# Altium project Current_sensor.PrjPcb
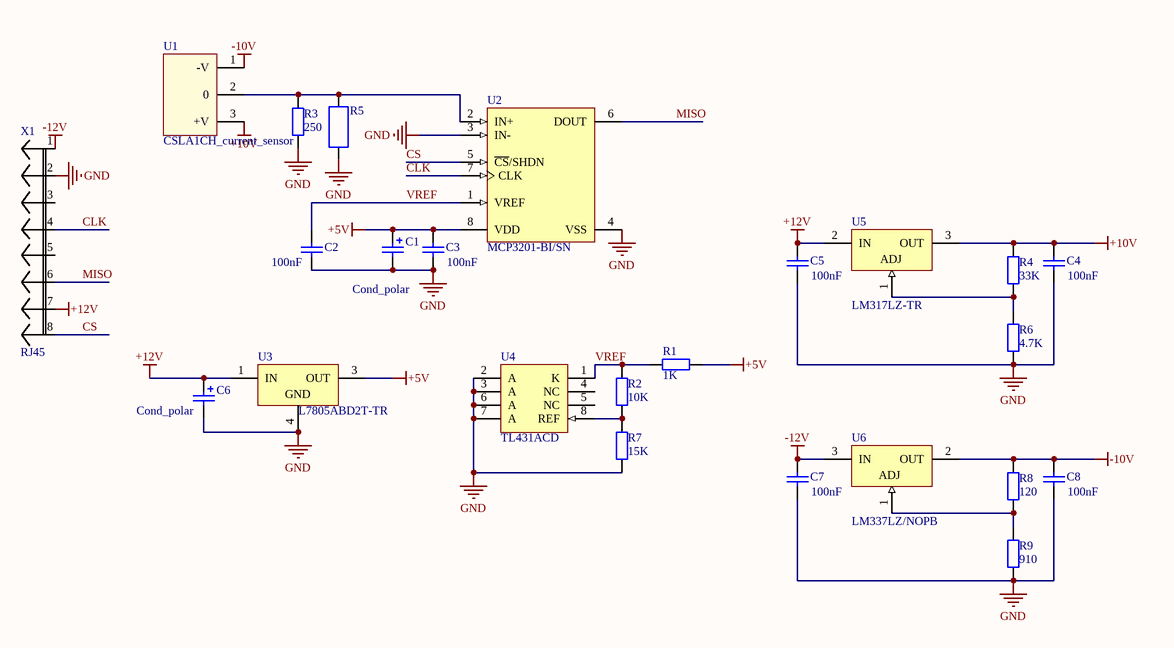
[diagram p0: Current_sensor.SchDoc]
1 sheet, 24 parts. Net scope: global (net labels, ports and power ports of the same name join across sheets).
Board file: Current_sensor.PcbDoc

## Sheet Current_sensor.SchDoc
size A4

### Parts
C1  Cond_polar  [CAP_EL_SMD_6.3mm]
C2  100nF  [C0805]
C3  100nF  [C0805]
C4  100nF  [C0805]
C5  100nF  [C0805]
C6  Cond_polar  [CAP_EL_SMD_6.3mm]
C7  100nF  [C0805]
C8  100nF  [C0805]
R1  1K  [R0805]
R2  10K  [R0805]
R3  250  [R0805]
R4  33K  [R0805]
R5  Resirtor_vivodnoi  [res_vivod]  (value not drawn)
R6  4.7K  [R0805]
R7  15K  [R0805]
R8  120  [R0805]
R9  910  [R0805]
U1  CSLA1CH_current_sensor  [CSLA1CH_current_sensor]
U2  MCP3201-BI/SN  [SO8]
U3  L7805ABD2T-TR  [TO-263_N]
U4  TL431ACD  [SO8_N]
U5  LM317LZ-TR  [TO-92]
U6  LM337LZ/NOPB  [Z03A]
X1  RJ45  [RJ45]

### Nets
+5V: C1.1 C3.2 R1.1 U2.8(VDD) U3.3(OUT)
+10V: C4.2 R4.1 U1.3(+V) U5.3(OUT)
+12V: C5.2 C6.1 U3.1(IN) U5.2(IN) X1.7
-10V: C8.2 R8.1 U1.1(-V) U6.2(OUT)
-12V: C7.2 U6.3(IN) X1.1
GND: C1.2 C2.1 C3.1 C4.1 C5.1 C6.2 C7.1 C8.1 R3.2 R5.1 R6.2 R7.1 R9.2 U2.3(IN-) U2.4(VSS) U3.4(GND) U4.2(A) U4.3(A) U4.6(A) U4.7(A) X1.2
CLK: U2.7(CLK) X1.4
CS: U2.5(~{CS}/SHDN) X1.8
MISO: U2.6(DOUT) X1.6
VREF: C2.2 R1.2 R2.2 U2.1(VREF) U4.1(K)
NetR2_1: R2.1 R7.2 U4.8(REF)
NetR3_1: R3.1 R5.2 U1.2(0) U2.2(IN+)
NetR4_2: R4.2 R6.1 U5.1(ADJ)
NetR8_2: R8.2 R9.1 U6.1(ADJ)

Not connected (* = marked no-connect by the designer): U4 4(NC) 5(NC); X1 3 5

### Library data of the parts
C2-C5 C7 C8 = Condensator
R1-R4 R6-R9 = Resistor
U3 = L7805ABD2T-TR: Positive Voltage Regulator, 3-Pin D2PAK, Tape and Reel; DatasheetVersion: Nov-2011; PackageVersion: 2011; PackageReference: TO-263; PackageDescription: 3-Pin Transistor Outline Package 2.54 mm Pitch, 15.4 mm Lead Span (D2PAK); PartNumber: L7805ABD2T-TR; ComponentLink1Description: Manufacturer URL; ComponentLink1URL: http://www.st.com; ComponentLink2Description: Datasheet; ComponentLink2URL: http://www.st.com/internet/com/TECHNICAL_RESOURCES/TECHNICAL_LITERATURE/DATASHEET/CD00000444.pdf
U4 = TL431ACD: Programmable Voltage Reference; Published: 24-Aug-2001; LatestRevisionDate: 13-Apr-2006; LatestRevisionNote: IPC-7351 Footprint Added.; DatasheetVersion: Nov-1998; PackageVersion: Dec-2002; PackageReference: SO8; Publisher: Altium Limited; PackageDescription: 8-Pin Small Outline Integrated Circuit 1.27 mm Pitch; Code_JEDEC: MS-012-AA; Code_IPC: SOIC127P600-8; ComponentLink1Description: Manufacturer Link; ComponentLink1URL: http://www.st.com/; ComponentLink2Description: Datasheet; ComponentLink2URL: http://www.st.com/stonline/products/literature/ds/4467/tl431.pdf
U5 = LM317LZ-TR: Low Current 1.2 to 37V Adjustable Voltage Regulator, 3-Pin TO-92, Tape and Reel; DatasheetVersion: May-2007; PackageVersion: 2011; PackageReference: TO-92; PackageDescription: TO, Flat Index; 3 In-Line, Axial Leads; Body Dia. 4.7mm; Lead Dia. 0.56 mm (max); PartNumber: LM317LZ-TR; ComponentLink1Description: Manufacturer URL; ComponentLink1URL: http://www.st.com; ComponentLink2Description: Datasheet; ComponentLink2URL: http://www.st.com/internet/com/TECHNICAL_RESOURCES/TECHNICAL_LITERATURE/DATASHEET/CD00000469.pdf
U6 = LM337LZ/NOPB: 3-Terminal Adjustable Regulator, 3-pin TO-92, Pb-Free; Manufacturer: National Semiconductor; PackageTopMarking: NSXYTT*LM337*LZ; PowerWise: N; CompType: LDO IC; High-Reliability: Y; DatasheetVersion: Jun-2005; PackageVersion: revG, Sep-2000; PackageReference: Z03A; PackageDescription: TO-92, Molded, 3 Lead; PartNumber: LM337LZ/NOPB; RoHS: Y; PinCount: 3; Code_JEDEC: TO-226-AA; ComponentLink1Description: Manufacturer URL; ComponentLink1URL: http://www.national.com/; ComponentLink2Description: LM337L Datasheet; ComponentLink2URL: http://www.national.com/ds/LM/LM337L.pdf; ComponentLink3Description: LM337L Web Page; ComponentLink3URL: http://www.national.com/pf/LM/LM337L.html; ComponentLink4Description: Z03A Package Page; ComponentLink4URL: http://www.national.com/packaging/folders/z03a.html